# EAGLE schematic Honduras Version 2 (EAGLE 9.1.2)
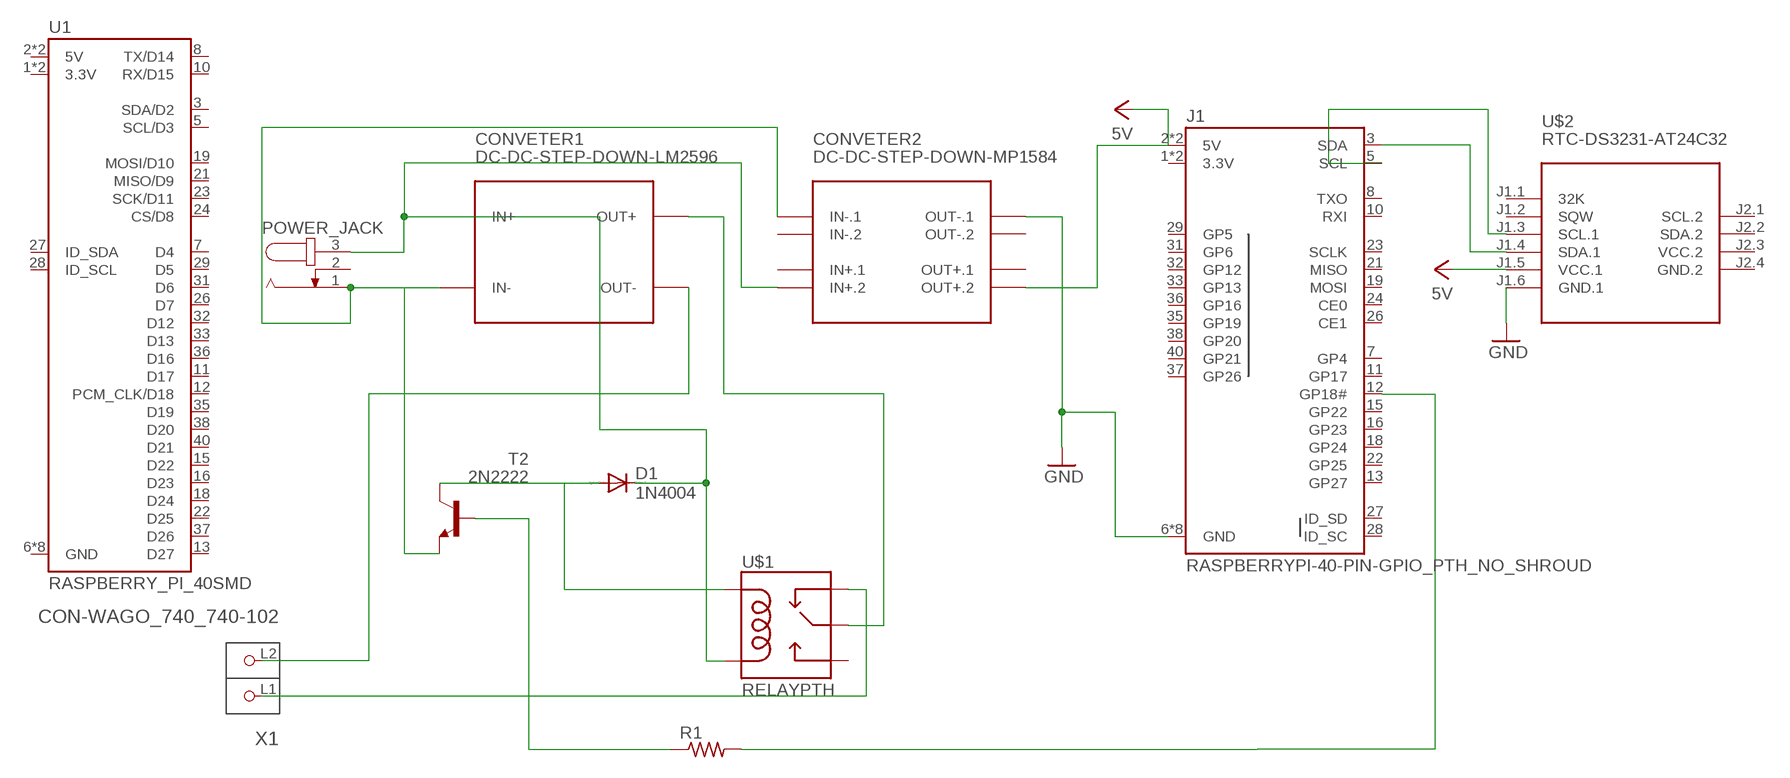
[diagram p0: schematic, sheet 1]

## Parts
CONVETER1  DC-DC-STEP-DOWN-LM2596  [DC-DC-STEP-DOWN-LM2596]
CONVETER2  DC-DC-STEP-DOWN-MP1584  [DC-DC-STEP-DOWN-MP1584]
D1  1N4004  [DO41-10]
J1  RASPBERRYPI-40-PIN-GPIO_PTH_NO_SHROUD  [2X20]
POWER_JACK  JACK-PLUG0  [SPC4077]
R1  R-US_0207/10  [0207/10]
T2  2N2222  [TO92-EBC-OVAL]
U1  RASPBERRY_PI_40SMD  [RASPBERRY_PI_SHIELD_HOLES]
U$1  RELAYPTH  [SRD-05VDC-SL-C]
U$2  RTC-DS3231-AT24C32  [RTC-DS3231-AT24C32]
X1  CON-WAGO_740_740-102  [CON-WAGO_740_P-740-102]

## Nets
GND [power]: CONVETER2.OUT-.1 J1.6(GND) J1.9(GND) J1.14(GND) J1.20(GND) J1.25(GND) J1.30(GND) J1.34(GND) J1.39(GND) U$2.J1.6(GND.1)
N$1 [power]: CONVETER1.IN+ CONVETER2.IN+.2 D1.C POWER_JACK.3 U$1.COIL0
N$2 [power]: J1.3(SDA) U$2.J1.4(SDA.1)
N$4 [power]: CONVETER1.OUT- X1.L2(P2)
N$5 [power]: CONVETER1.IN- CONVETER2.IN-.1 POWER_JACK.1 T2.E
N$7: J1.12(GP18#) R1.2
N$8 [power]: D1.A T2.C U$1.COIL1
N$11 [power]: R1.1 T2.B
N$12 [power]: U$1.SWCLOSED(SWCLOSE) X1.L1(P1)
N$13 [power]: CONVETER1.OUT+ U$1.SWCOMMON
N$50 [power]: J1.5(SCL) U$2.J1.3(SCL.1)
VCC [power]: CONVETER2.OUT+.2 J1.2(5V) J1.4(5V) U$2.J1.5(VCC.1) ; supply symbol labelled 5V
Unconnected: CONVETER2.IN+.1 CONVETER2.IN-.2 CONVETER2.OUT+.1 CONVETER2.OUT-.2 J1.7(GP4) J1.8(TXO) J1.10(RXI) J1.11(GP17) J1.13(GP27) J1.15(GP22) J1.16(GP23) J1.18(GP24) J1.19(MOSI) J1.21(MISO) J1.22(GP25) J1.23(SCLK) J1.24(CE0) J1.26(CE1) J1.27(ID_SD) J1.28(ID_SC) J1.29(GP5) J1.31(GP6) J1.32(GP12) J1.33(GP13) J1.35(GP19) J1.36(GP16) J1.37(GP26) J1.38(GP20) J1.40(GP21) POWER_JACK.2 U1.1(3.3V) U1.2(5V) U1.3(SDA/D2) U1.4(5V) U1.5(SCL/D3) U1.6(GND) U1.7(D4) U1.8(TX/D14) U1.9(GND) U1.10(RX/D15) U1.11(D17) U1.12(PCM_CLK/D18) U1.13(D27) U1.14(GND) U1.15(D22) U1.16(D23) U1.17(3.3V) U1.18(D24) U1.19(MOSI/D10) U1.20(GND) U1.21(MISO/D9) U1.22(D25) U1.23(SCK/D11) U1.24(CS/D8) U1.25(GND) U1.26(D7) U1.27(ID_SDA) U1.28(ID_SCL) U1.29(D5) U1.30(GND) U1.31(D6) U1.32(D12) U1.33(D13) U1.34(GND) U1.35(D19) U1.36(D16) U1.37(D26) U1.38(D20) U1.39(GND) U1.40(D21) U$1.SWOPEN U$2.J1.1(32K) U$2.J1.2(SQW) U$2.J2.1(SCL.2) U$2.J2.2(SDA.2)

## Power pins joined to a net without a drawn wire
3.3V: J1.1(3.3V) J1.17(3.3V)
GND.2: U$2.J2.4(GND.2)
VCC.2: U$2.J2.3(VCC.2)

## Library data of the parts
CONVETER1 = GHIdiy-modules:DC-DC-STEP-DOWN-LM2596: DC/DC Step-Down Regulator based on LM2596-ADJ chip LM2596 datasheet available here: http://www.ti.com/lit/ds/symlink/lm2596.pdf Click here to find device on ebay.com <http://www.ebay.com/sch/lm2596+power+regulator>
CONVETER2 = GHIdiy-modules:DC-DC-STEP-DOWN-MP1584: DC/DC Step-Down Regulator based on MP1584 chip MP1584 datasheet available here: http://www.haoyuelectronics.com/Attachment/MP1584/MP1584.pdf Click here to find device on ebay.com <http://www.ebay.com/sch/mp1584+module>
D1 = diode:1N4004: DIODE general purpose rectifier, 1 A
J1 = GHIISparkFun-Connectors:RASPBERRYPI-40-PIN-GPIO: Raspberry Pi GPIO Header 2x20 pin connector, as found on B, B+, A+ models. Both shrouded PTH and SMT versions available. SparkFun Products: GPIO Shrouded Header <https://www.sparkfun.com/products/13054>- PTH SparkFun Pi Wedge (Preassembled) <https://www.sparkfun.com/products/13717>
POWER_JACK = con-jack:JACK-PLUG: DC POWER JACK Power Jack, DC, Right Angle, Through Hole, Rated 5A at 16VDC, PC Terminals Distributor: Farnell (www.Farnell.de) Drawing: 84N1161.pdf / 84N1162.pdf Manufacturer: SPC Technology (www.spctechnology.com) Type: SPC4077 / SPC 4078; OC_FARNELL: unknown; OC_NEWARK: unknown
R1 = adafruit:R-US_: RESISTOR, American symbol
T2 = adafruit:2N2222: NPN TRANSISTOR Big oval pads
U1 = SparkFun-Connectors:RASPBERRY_PI_40
U$1 = SRD-Relay:RELAY: SPDT relay (COM-00101)
U$2 = GHIdiy-modules:RTC-DS3231-AT24C32: RTC Module with Battery and EEPROM based on DS3231 and AT24C32 chips Tutorial can be found here: https://edwardmallon.wordpress.com/2014/05/21/using-a-cheap-3-ds3231-rtc-at24c32-eeprom-from-ebay/ Click here to find device on ebay.com <http://www.ebay.com/sch/DS3231+AT24C32+module>
X1 = Termnal block:CON-WAGO_740_740-102: Serie 740, Klemmenleiste für Leiterplatten 1 Lötstift/Pol / Series 740, PCB terminal strip 1 solder pin/pole Polzahl / Pole No.: 2 Rastermaß / Pitch: 5 mm Bemessungsspannung / Rated Voltage: 320 V Nennstrom / Nominal Current: 16 A Leiterquerschnitt / Conductor Size: 0.08 - 2.5 mm² Anschlusstechnik / Connection Technology: CAGE CLAMP® Lötstiftlänge: / Solder Pin Length: 5.1 mm Leitereinführung (zur Platine) / Conductor entry angle (to PCB): 0 ° Farbe / Color: grau / gray Stand: 01.01.2012. Die jeweils aktuellen Daten zu diesem Artikel finden Sie in unserem Produktkatalog, den Sie unter www.wago.com einsehen können. As of: 01/01/2012. Please find the newest data for this article in our product catalogue, which can be viewed under www.wago.com.

## Net classes
0 default: width 0.762 mm, drill 0.762 mm, clearance 0.635 mm
1 power: width 1 mm, drill 1 mm, clearance 0.635 mm
2 data: width 0.762 mm, drill 0.762 mm, clearance 0.635 mm